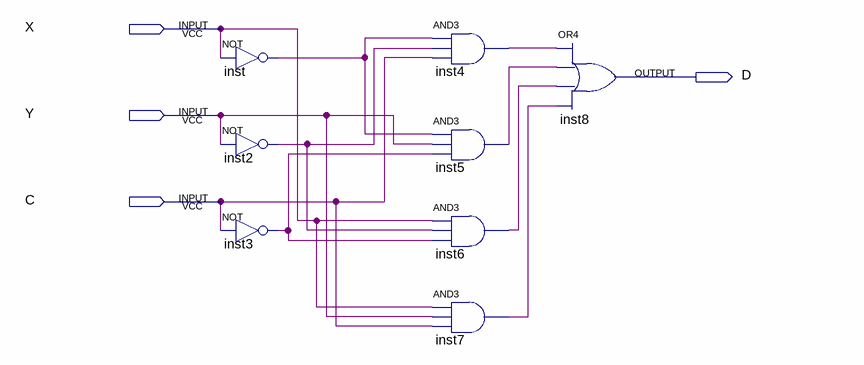
[diagram p0: schematic sheet]
// Quartus schematic D.bdf as structural Verilog: 8 symbols, 4 pins
module D (
  input  X,
  input  Y,
  input  C,
  output D
);

  wire inst2_out, inst3_out, inst4_out, inst5_out, inst6_out, inst7_out, inst_out;

  not inst (inst_out, X);
  not inst2 (inst2_out, Y);
  not inst3 (inst3_out, C);
  and inst4 (inst4_out, inst_out, inst2_out, C);
  and inst5 (inst5_out, inst_out, Y, inst3_out);
  and inst6 (inst6_out, X, inst2_out, inst3_out);
  and inst7 (inst7_out, X, Y, C);
  or inst8 (D, inst4_out, inst5_out, inst6_out, inst7_out);
endmodule
